# Altium schematic sheet FPGA_Clocks.SchDoc
size A; DocumentNumber: 6; SheetNumber: 6; SheetTotal: 8; PageSetup: Record=PageOptions|CenterHorizontal=True|CenterVertical=True|PrintScale=1.12|XCorrection=1.00|YCorrection=1.00|PrintKind=0|BorderSize=5000000|LeftOffset=0|BottomOffset=0|Orientation=2|PaperLength=1000|PaperWidth=1000|Scale=100|PaperSource=7|PrintQuality=-4|MediaType=1|DitherType=10|PaperKind=Letter|PrintScaleMode=1
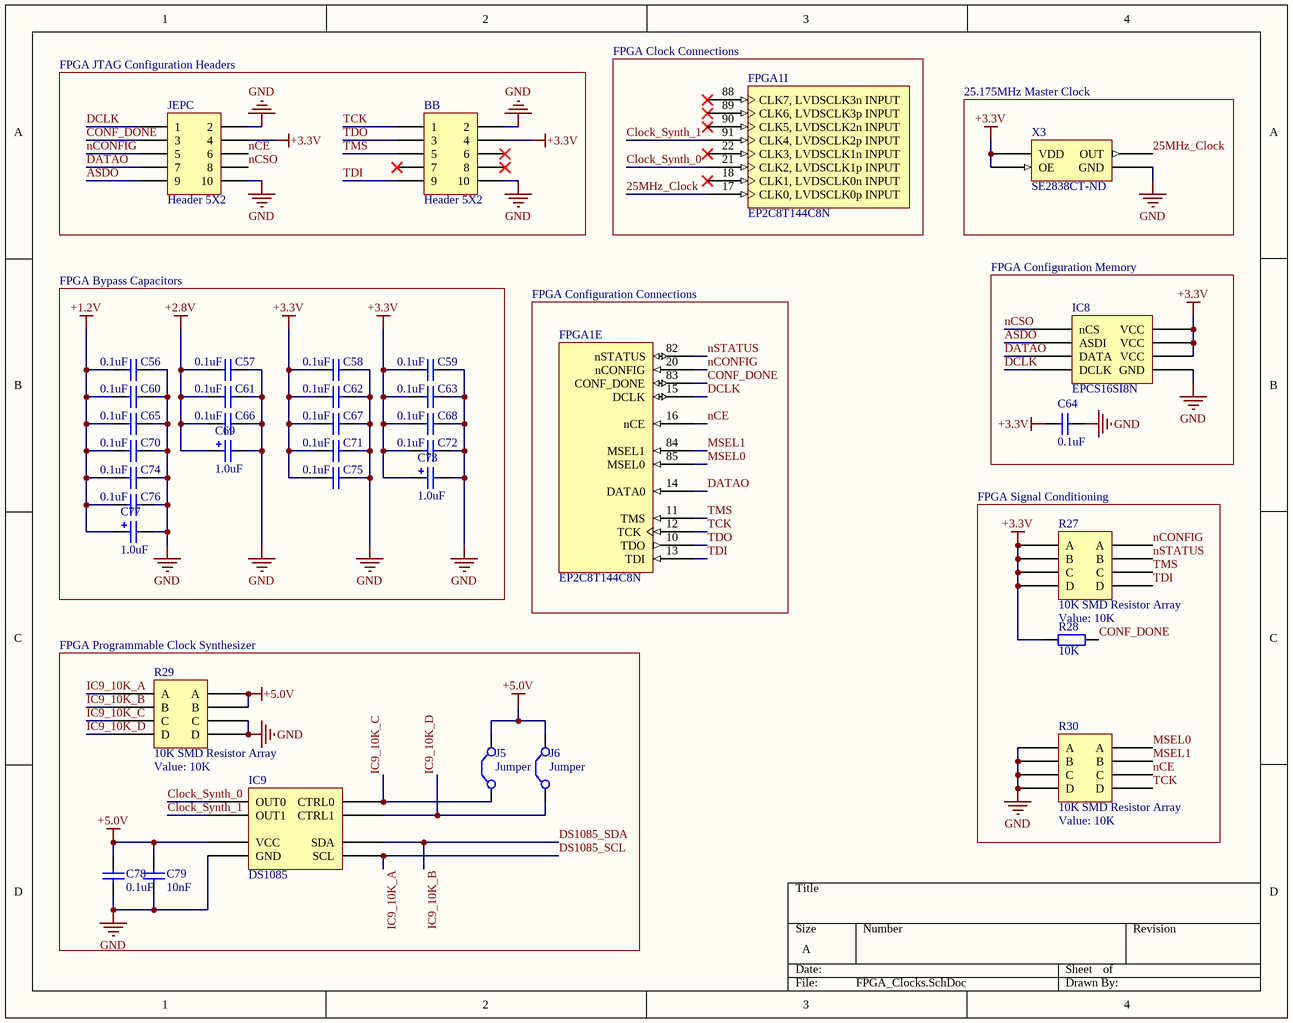
[diagram p0: FPGA_Clocks.SchDoc]

## Parts
BB  Header 5X2  [HDR2X5]
C56  value 0.1uF  [SMD 1206]  (hidden comment: 0.1uF SMD 1206)
C57  value 0.1uF  [SMD 1206]  (hidden comment: 0.1uF SMD 1206)
C58  value 0.1uF  [SMD 1206]  (hidden comment: 0.1uF SMD 1206)
C59  value 0.1uF  [SMD 1206]  (hidden comment: 0.1uF SMD 1206)
C60  value 0.1uF  [SMD 1206]  (hidden comment: 0.1uF SMD 1206)
C61  value 0.1uF  [SMD 1206]  (hidden comment: 0.1uF SMD 1206)
C62  value 0.1uF  [SMD 1206]  (hidden comment: 0.1uF SMD 1206)
C63  value 0.1uF  [SMD 1206]  (hidden comment: 0.1uF SMD 1206)
C64  value 0.1uF  [SMD 1206]  (hidden comment: 0.1uF SMD 1206)
C65  value 0.1uF  [SMD 1206]  (hidden comment: 0.1uF SMD 1206)
C66  value 0.1uF  [SMD 1206]  (hidden comment: 0.1uF SMD 1206)
C67  value 0.1uF  [SMD 1206]  (hidden comment: 0.1uF SMD 1206)
C68  value 0.1uF  [SMD 1206]  (hidden comment: 0.1uF SMD 1206)
C69  value 1.0uF  [Capacitor - Tantalum Case A]  (hidden comment: 1.0uF Low-ESR Tantalum CaseA)
C70  value 0.1uF  [SMD 1206]  (hidden comment: 0.1uF SMD 1206)
C71  value 0.1uF  [SMD 1206]  (hidden comment: 0.1uF SMD 1206)
C72  value 0.1uF  [SMD 1206]  (hidden comment: 0.1uF SMD 1206)
C73  value 1.0uF  [Capacitor - Tantalum Case A]  (hidden comment: 1.0uF Low-ESR Tantalum CaseA)
C74  value 0.1uF  [SMD 1206]  (hidden comment: 0.1uF SMD 1206)
C75  value 0.1uF  [SMD 1206]  (hidden comment: 0.1uF SMD 1206)
C76  value 0.1uF  [SMD 1206]  (hidden comment: 0.1uF SMD 1206)
C77  value 1.0uF  [Capacitor - Tantalum Case A]  (hidden comment: 1.0uF Low-ESR Tantalum CaseA)
C78  value 0.1uF  [SMD 1206]  (hidden comment: 0.1uF SMD 1206)
C79  value 10nF  [SMD 1206]  (hidden comment: 10nF SMD 1206)
FPGA1  EP2C8T144C8N  [TQFP144_N]  (parts E,I of 9)
IC8  EPCS16SI8N  [EPCS16SI8N SO-8]
IC9  DS1085  [DS1085 SO-150mil]
J5  Jumper  [HDR1X2]
J6  Jumper  [HDR1X2]
JEPC  Header 5X2  [HDR2X5]
R27  10K SMD Resistor Array  value 10K  [Resistor Array YC164]
R28  value 10K  [SMD 0805]  (hidden comment: 10K SMD 0805)
R29  10K SMD Resistor Array  value 10K  [Resistor Array YC164]
R30  10K SMD Resistor Array  value 10K  [Resistor Array YC164]
X3  SE2838CT-ND  [SG-636PCE 25.175MHz Crystal]

## Blocks framed on the sheet
FPGA JTAG Configuration Headers: BB JEPC
FPGA Clock Connections: FPGA1
25.175MHz Master Clock: X3
FPGA Bypass Capacitors: C56-C63 C65-C77
FPGA Configuration Memory: C64 IC8
FPGA Configuration Connections: FPGA1
FPGA Signal Conditioning: R27 R28 R30
FPGA Programmable Clock Synthesizer: C78 C79 IC9 J5 J6 R29

## Nets
+1.2V: C56.1 C60.1 C65.1 C70.1 C74.1 C76.1 C77.1(+)
+2.8V: C57.1 C61.1 C66.1 C69.1(+)
+3.3V: BB.4 C58.1 C59.1 C62.1 C63.1 C64.1 C67.1 C68.1 C71.1 C72.1 C73.1(+) C75.1 IC8.2(VCC) IC8.6(VCC) IC8.7(VCC) JEPC.4 R27.5(A) R27.6(B) R27.7(C) R27.8(D) R28.1 X3.0(OE) X3.3(VDD)
+5.0V: C78.2 C79.2 IC9.2(VCC) J5.2(C2) J6.2(C2) R29.1(A) R29.2(B)
GND: BB.2 BB.10 C56.2 C57.2 C58.2 C59.2 C60.2 C61.2 C62.2 C63.2 C64.2 C65.2 C66.2 C67.2 C68.2 C69.2(-) C70.2 C71.2 C72.2 C73.2(-) C74.2 C75.2 C76.2 C77.2(-) C78.1 C79.1 IC8.3(GND) IC9.3(GND) JEPC.2 JEPC.10 R29.3(C) R29.4(D) R30.5(A) R30.6(B) R30.7(C) R30.8(D) X3.1(GND)
25MHz_Clock: FPGA1.17(CLK0,_LVDSCLK0p_INPUT) X3.2(OUT)
ASDO: IC8.4(ASDI) JEPC.9
Clock_Synth_0: FPGA1.21(CLK2,_LVDSCLK1p_INPUT) IC9.1(OUT0)
Clock_Synth_1: FPGA1.91(CLK4,_LVDSCLK2p_INPUT) IC9.0(OUT1)
CONF_DONE: FPGA1.83(CONF_DONE) JEPC.3 R28.2
DATAO: FPGA1.14(DATA0) IC8.1(DATA) JEPC.7
DCLK: FPGA1.15(DCLK) IC8.5(DCLK) JEPC.1
DS1085_SCL: IC9.7(SCL) R29.5(A)  [also labelled IC9_10K_A]
DS1085_SDA: IC9.6(SDA) R29.6(B)  [also labelled IC9_10K_B]
IC9_10K_C: IC9.4(CTRL0) J5.1(C1) R29.7(C)
IC9_10K_D: IC9.5(CTRL1) J6.1(C1) R29.8(D)
MSEL0: FPGA1.85(MSEL0) R30.1(A)
MSEL1: FPGA1.84(MSEL1) R30.2(B)
nCE: FPGA1.16(nCE) JEPC.6 R30.3(C)
nCONFIG: FPGA1.20(nCONFIG) JEPC.5 R27.1(A)
nCSO: IC8.0(nCS) JEPC.8
nSTATUS: FPGA1.82(nSTATUS) R27.2(B)
TCK: BB.1 FPGA1.12(TCK) R30.4(D)
TDI: BB.9 FPGA1.13(TDI) R27.4(D)
TDO: BB.3 FPGA1.10(TDO)
TMS: BB.5 FPGA1.11(TMS) R27.3(C)

Not connected (* = marked no-connect by the designer): BB 6* 7* 8*; FPGA1 18(CLK1,_LVDSCLK0n_INPUT)* 22(CLK3,_LVDSCLK1n_INPUT)* 88(CLK7,_LVDSCLK3n_INPUT)* 89(CLK6,_LVDSCLK3p_INPUT)* 90(CLK5,_LVDSCLK2n_INPUT)*

## Library data of the parts
BB JEPC = Header 5X2: Header, 5-Pin, Dual row; LatestRevisionDate: 17-Jul-2002; LatestRevisionNote: Re-released for DXP Platform.; Publisher: Altium Limited
C56-C68 C70-C72 C74-C76 C78 C79 = Cap: Capacitor
C69 C73 C77 = SMD_Cap_Tantalum: Tantalum Capacitor - Case A
FPGA1 = EP2C8T144C8N: Cyclone II Family, 1.2V FPGA, 85 I/O Pins, 2 PLLs, 144-Pin TQFP, Speed Grade 8, Commercial Grade, Pb-Free; Published: 4-Mar-2005; LatestRevisionDate: 14-May-2007; LatestRevisionNote: DATA0 pin is now INPUT.; DatasheetVersion: ver3.3, Feb-2008; PackageVersion: ver15.4, Dec-2008; PackageReference: TQFP144; Publisher: Altium Limited; PackageDescription: 144-Pin Plastic Thin Quad Flat Pack (TQFP144) - Wire Bond; Supplier 1: Digi-Key; Supplier Part Number 1: 544-1666-ND; Supplier 2: Farnell; Supplier Part Number 2: 1453487; Supplier 3: Farnell; Supplier Part Number 3: 1662256; Code_JEDEC: MS-026-BFB; ComponentLink1Description: Manufacturer Link; ComponentLink1URL: http://www.altera.com/products/devices/cyclone2/cy2-index.jsp; ComponentLink2Description: Handbook; ComponentLink2URL: http://www.altera.com/literature/hb/cyc2/cyc2_cii5v1.pdf; ComponentLink3Description: Packaging Specification; ComponentLink3URL: http://www.altera.com/literature/ds/dspkg.pdf
IC8 = EPCS16SI8N: 16MB FPGA CONFIGURATION DEVICE; pin to pad: 0>1 1>2 2>3 3>4 4>5 5>6 6>7 7>8
IC9 = DS1085: EconOscillator Frequency Synthesizer; pin to pad: 0>1 1>2 2>3 3>4 4>5 5>6 6>7 7>8
J5 J6 = Jumper: Jumper Wire; Published: 24-Mar-1999; LatestRevisionDate: 17-Jul-2002; LatestRevisionNote: Re-released for DXP Platform.; PackageReference: RAD-0.2; Publisher: Altium Limited; PackageDescription: Radial Cap, Thru-Hole; 2 Leads; 0.2 in Pin Spacing
R27 R29 R30 = SMD Resistor Array: 4-Count Resistor Array; pin to pad: 5>8 6>7 7>6 8>5
R28 = Res2: Resistor
X3 = SE2838CT-ND: OSCILLATOR 25.1750MHZ SMD; pin to pad: 0>1 1>2 2>3 3>4